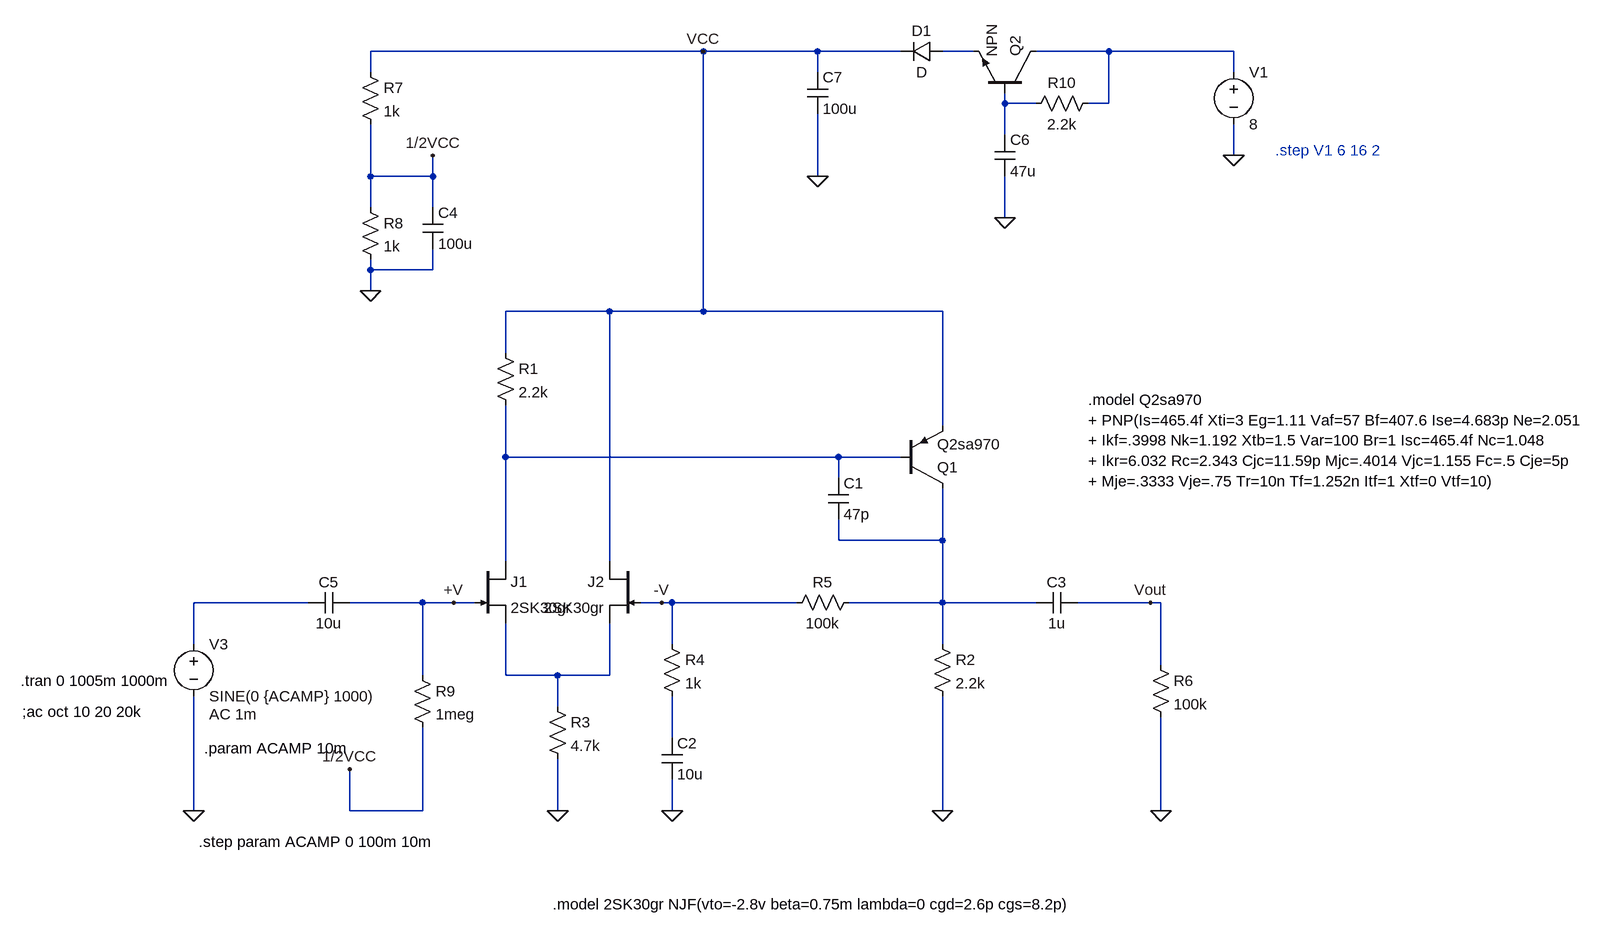
[diagram p0: schematic Discrete_OP.asc]
Discrete_OP.asc, the LTspice schematic file:
Version 4
SHEET 1 2076 680
WIRE 608 -960 96 -960
WIRE 784 -960 608 -960
WIRE 912 -960 784 -960
WIRE 1024 -960 976 -960
WIRE 1232 -960 1120 -960
WIRE 1424 -960 1232 -960
WIRE 96 -928 96 -960
WIRE 784 -928 784 -960
WIRE 1424 -928 1424 -960
WIRE 1072 -880 1072 -896
WIRE 1120 -880 1072 -880
WIRE 1232 -880 1232 -960
WIRE 1232 -880 1200 -880
WIRE 1072 -832 1072 -880
WIRE 1424 -800 1424 -848
WIRE 96 -768 96 -848
WIRE 192 -768 192 -800
WIRE 192 -768 96 -768
WIRE 784 -768 784 -864
WIRE 96 -720 96 -768
WIRE 192 -720 192 -768
WIRE 1072 -704 1072 -768
WIRE 96 -624 96 -640
WIRE 192 -624 192 -656
WIRE 192 -624 96 -624
WIRE 96 -592 96 -624
WIRE 464 -560 304 -560
WIRE 608 -560 608 -960
WIRE 608 -560 464 -560
WIRE 976 -560 608 -560
WIRE 304 -496 304 -560
WIRE 976 -384 976 -560
WIRE 304 -336 304 -416
WIRE 816 -336 304 -336
WIRE 912 -336 816 -336
WIRE 816 -304 816 -336
WIRE 816 -208 816 -240
WIRE 976 -208 976 -288
WIRE 976 -208 816 -208
WIRE 304 -176 304 -336
WIRE 464 -176 464 -560
WIRE 0 -112 -176 -112
WIRE 176 -112 64 -112
WIRE 224 -112 176 -112
WIRE 256 -112 224 -112
WIRE 544 -112 512 -112
WIRE 560 -112 544 -112
WIRE 752 -112 560 -112
WIRE 976 -112 976 -208
WIRE 976 -112 832 -112
WIRE 1120 -112 976 -112
WIRE 1296 -112 1184 -112
WIRE 1312 -112 1296 -112
WIRE -176 -48 -176 -112
WIRE 560 -48 560 -112
WIRE 976 -48 976 -112
WIRE 1312 -16 1312 -112
WIRE 176 0 176 -112
WIRE 304 0 304 -80
WIRE 384 0 304 0
WIRE 464 0 464 -80
WIRE 464 0 384 0
WIRE 384 48 384 0
WIRE 560 96 560 32
WIRE -176 208 -176 32
WIRE 64 208 64 144
WIRE 176 208 176 80
WIRE 176 208 64 208
WIRE 384 208 384 128
WIRE 560 208 560 160
WIRE 976 208 976 32
WIRE 1312 208 1312 64
FLAG -176 208 0
FLAG 384 208 0
FLAG 976 208 0
FLAG 1312 208 0
FLAG 1424 -800 0
FLAG 560 208 0
FLAG 1296 -112 Vout
FLAG 224 -112 +V
FLAG 544 -112 -V
FLAG 608 -960 VCC
FLAG 96 -592 0
FLAG 192 -800 1/2VCC
FLAG 64 144 1/2VCC
FLAG 1072 -704 0
FLAG 784 -768 0
SYMBOL njf 256 -176 R0
SYMATTR InstName J1
SYMATTR Value 2SK30gr
SYMBOL njf 512 -176 M0
SYMATTR InstName J2
SYMATTR Value 2SK30gr
SYMBOL pnp 912 -288 M180
SYMATTR InstName Q1
SYMATTR Value Q2sa970
SYMBOL res 288 -512 R0
SYMATTR InstName R1
SYMATTR Value 2.2k
SYMBOL res 960 -64 R0
SYMATTR InstName R2
SYMATTR Value 2.2k
SYMBOL cap 800 -304 R0
SYMATTR InstName C1
SYMATTR Value 47p
SYMBOL res 368 32 R0
SYMATTR InstName R3
SYMATTR Value 4.7k
SYMBOL voltage 1424 -944 R0
WINDOW 123 0 0 Left 2
WINDOW 39 0 0 Left 2
SYMATTR InstName V1
SYMATTR Value 8
SYMBOL cap 544 96 R0
SYMATTR InstName C2
SYMATTR Value 10u
SYMBOL res 544 -64 R0
SYMATTR InstName R4
SYMATTR Value 1k
SYMBOL res 848 -128 R90
WINDOW 0 0 56 VBottom 2
WINDOW 3 32 56 VTop 2
SYMATTR InstName R5
SYMATTR Value 100k
SYMBOL voltage -176 -64 R0
WINDOW 123 24 124 Left 2
WINDOW 39 0 0 Left 2
SYMATTR InstName V3
SYMATTR Value SINE(0 {ACAMP} 1000)
SYMATTR Value2 AC 1m
SYMBOL res 1296 -32 R0
SYMATTR InstName R6
SYMATTR Value 100k
SYMBOL cap 1184 -128 R90
WINDOW 0 0 32 VBottom 2
WINDOW 3 32 32 VTop 2
SYMATTR InstName C3
SYMATTR Value 1u
SYMBOL res 80 -944 R0
SYMATTR InstName R7
SYMATTR Value 1k
SYMBOL res 80 -736 R0
SYMATTR InstName R8
SYMATTR Value 1k
SYMBOL cap 176 -720 R0
SYMATTR InstName C4
SYMATTR Value 100u
SYMBOL res 160 -16 R0
SYMATTR InstName R9
SYMATTR Value 1meg
SYMBOL cap 64 -128 R90
WINDOW 0 0 32 VBottom 2
WINDOW 3 32 32 VTop 2
SYMATTR InstName C5
SYMATTR Value 10u
SYMBOL npn 1120 -896 M270
SYMATTR InstName Q2
SYMBOL res 1216 -896 R90
WINDOW 0 0 56 VBottom 2
WINDOW 3 32 56 VTop 2
SYMATTR InstName R10
SYMATTR Value 2.2k
SYMBOL cap 1056 -832 R0
SYMATTR InstName C6
SYMATTR Value 47u
SYMBOL diode 976 -976 R90
WINDOW 0 0 32 VBottom 2
WINDOW 3 32 32 VTop 2
SYMATTR InstName D1
SYMBOL cap 768 -928 R0
SYMATTR InstName C7
SYMATTR Value 100u
TEXT 1200 -424 Left 2 !.model Q2sa970 \n+ PNP(Is=465.4f Xti=3 Eg=1.11 Vaf=57 Bf=407.6 Ise=4.683p Ne=2.051\n+ Ikf=.3998 Nk=1.192 Xtb=1.5 Var=100 Br=1 Isc=465.4f Nc=1.048\n+ Ikr=6.032 Rc=2.343 Cjc=11.59p Mjc=.4014 Vjc=1.155 Fc=.5 Cje=5p\n+ Mje=.3333 Vje=.75 Tr=10n Tf=1.252n Itf=1 Xtf=0 Vtf=10)
TEXT -442 8 Left 2 !.tran 0 1005m 1000m
TEXT 376 352 Left 2 !.model 2SK30gr NJF(vto=-2.8v beta=0.75m lambda=0 cgd=2.6p cgs=8.2p)
TEXT 1488 -808 Left 2 ;.step V1 6 16 2
TEXT -440 56 Left 2 !;ac oct 10 20 20k
TEXT -160 112 Left 2 !.param ACAMP 10m
TEXT -168 256 Left 2 !.step param ACAMP 0 100m 10m

The netlist it stands for:
* Discrete_OP.asc
J1 N004 +V N007 2SK30gr
J2 VCC -V N007 2SK30gr
Q1 N005 N004 VCC 0 Q2sa970
R1 VCC N004 2.2k
R2 N005 0 2.2k
C1 N004 N005 47p
R3 N007 0 4.7k
V1 N002 0 8
C2 N008 0 10u
R4 -V N008 1k
R5 N005 -V 100k
V3 N006 0 SINE(0 {ACAMP} 1000) AC 1m
R6 Vout 0 100k
C3 Vout N005 1u
R7 VCC 1/2VCC 1k
R8 1/2VCC 0 1k
C4 1/2VCC 0 100u
R9 +V 1/2VCC 1meg
C5 +V N006 10u
Q2 N002 N003 N001 0 NPN
R10 N002 N003 2.2k
C6 N003 0 47u
D1 N001 VCC D
C7 VCC 0 100u
.model D D
.lib standard.dio
.model NPN NPN
.model PNP PNP
.lib standard.bjt
.model NJF NJF
.model PJF PJF
.lib standard.jft
.model Q2sa970
+ PNP(Is=465.4f Xti=3 Eg=1.11 Vaf=57 Bf=407.6 Ise=4.683p Ne=2.051
+ Ikf=.3998 Nk=1.192 Xtb=1.5 Var=100 Br=1 Isc=465.4f Nc=1.048
+ Ikr=6.032 Rc=2.343 Cjc=11.59p Mjc=.4014 Vjc=1.155 Fc=.5 Cje=5p
+ Mje=.3333 Vje=.75 Tr=10n Tf=1.252n Itf=1 Xtf=0 Vtf=10)
.tran 0 1005m 1000m
.model 2SK30gr NJF(vto=-2.8v beta=0.75m lambda=0 cgd=2.6p cgs=8.2p)
* .step V1 6 16 2
;ac oct 10 20 20k
.param ACAMP 10m
.step param ACAMP 0 100m 10m
.backanno
.end